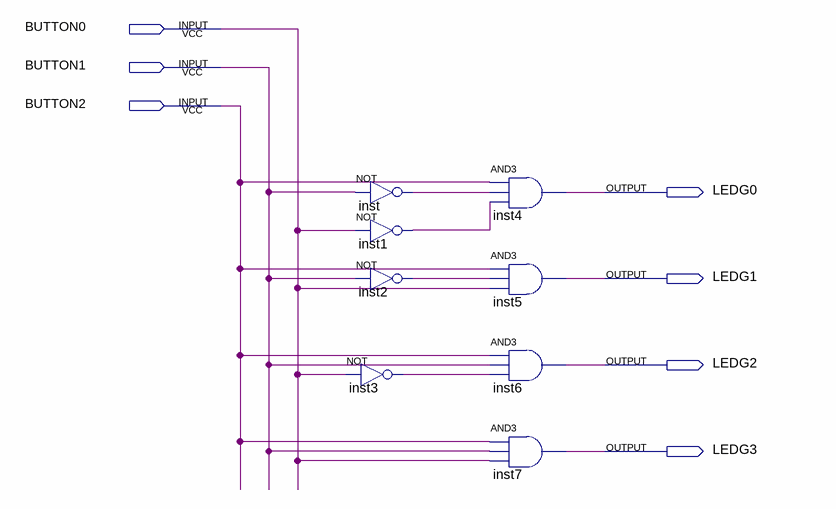
[diagram p0: schematic sheet]
// Quartus schematic lab4_2.bdf as structural Verilog: 8 symbols, 7 pins
module lab4_2 (
  input  BUTTON0,
  input  BUTTON1,
  input  BUTTON2,
  output LEDG0,
  output LEDG1,
  output LEDG2,
  output LEDG3
);

  wire inst1_out, inst2_out, inst3_out, inst_out;

  not inst (inst_out, BUTTON1);
  not inst1 (inst1_out, BUTTON0);
  not inst2 (inst2_out, BUTTON1);
  not inst3 (inst3_out, BUTTON0);
  and inst4 (LEDG0, BUTTON2, inst_out, inst1_out);
  and inst5 (LEDG1, BUTTON2, inst2_out, BUTTON0);
  and inst6 (LEDG2, BUTTON2, BUTTON1, inst3_out);
  and inst7 (LEDG3, BUTTON2, BUTTON1, BUTTON0);
endmodule
